# Altium schematic sheet SD_Card.SchDoc
size A4
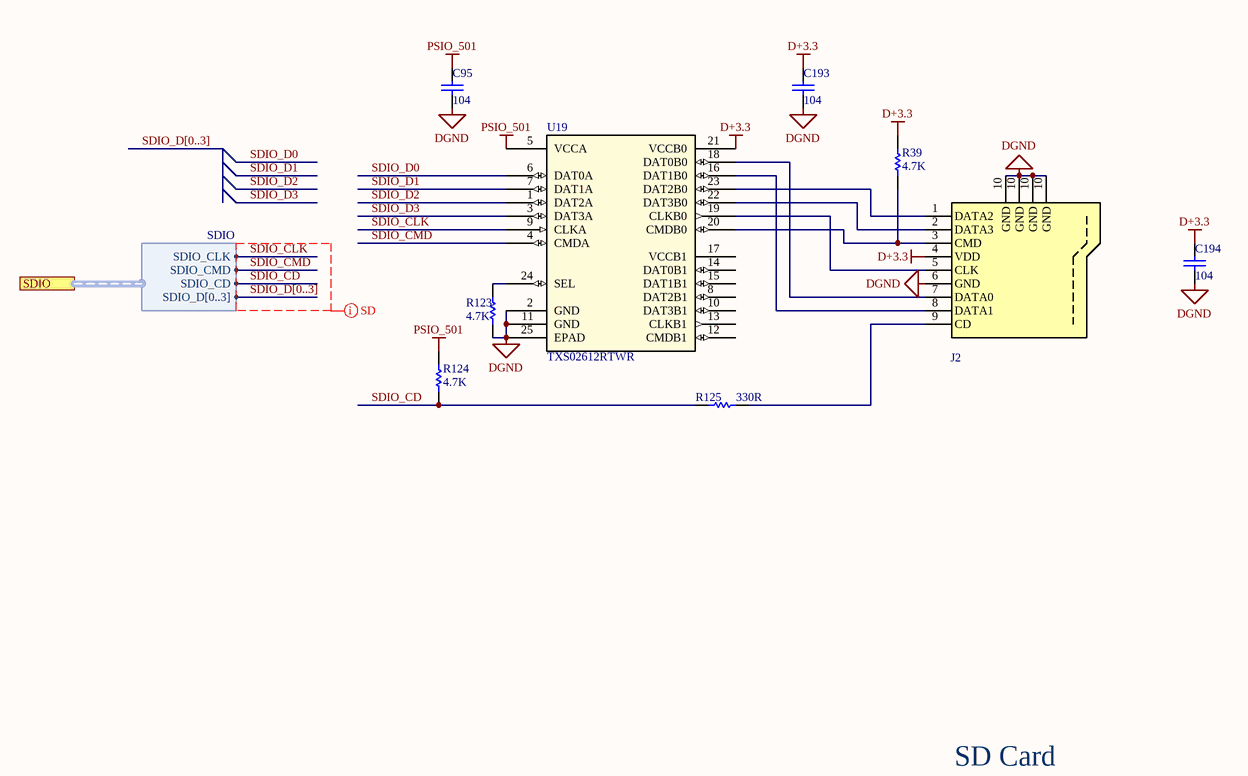
[diagram p0: SD_Card.SchDoc]

## Parts
C95  104  [C 0402_LL]
C193  104  [C 0402_LL]
C194  104  [C 0402_LL]
J2  SD_Card  [Micro SD]  (value not drawn)
R39  4.7K  [R 0603_L]
R123  4.7K  [R 0603_L]
R124  4.7K  [R 0603_L]
R125  330R  [R 0603_L]
U19  TXS02612RTWR  [RTW24_2P45X2P45]

## Ports
SDIO (harness SDIO)

## Harnesses
SDIO: SDIO_CLK, SDIO_CMD, SDIO_D[0..3], SDIO_CD

## Nets
D+3.3: C193.1 C194.1 J2.4(VDD) R39.1 U19.21(VCCB0)
DGND: C95.2 C193.2 C194.2 J2.6(GND) J2.10(GND) R123.2 U19.2(GND) U19.11(GND) U19.25(EPAD)
PSIO_501: C95.1 R124.1 U19.5(VCCA)
SDIO_CD: R124.2 R125.1 ; port SDIO.SDIO_CD
SDIO_CLK: U19.9(CLKA) ; port SDIO.SDIO_CLK
SDIO_CMD: U19.4(CMDA) ; port SDIO.SDIO_CMD
SDIO_D0: U19.6(DAT0A)
SDIO_D1: U19.7(DAT1A)
SDIO_D2: U19.1(DAT2A)
SDIO_D3: U19.3(DAT3A)
NetJ2_1: J2.1(DATA2) U19.23(DAT2B0)
NetJ2_2: J2.2(DATA3) U19.22(DAT3B0)
NetJ2_3: J2.3(CMD) R39.2 U19.20(CMDB0)
NetJ2_5: J2.5(CLK) U19.19(CLKB0)
NetJ2_7: J2.7(DATA0) U19.18(DAT0B0)
NetJ2_8: J2.8(DATA1) U19.16(DAT1B0)
NetJ2_9: J2.9(CD) R125.2
NetR123_1: R123.1 U19.24(SEL)

Not connected (* = marked no-connect by the designer): U19 8(DAT2B1) 10(DAT3B1) 12(CMDB1) 13(CLKB1) 14(DAT0B1) 15(DAT1B1) 17(VCCB1)

## Buses and harness runs
bus SDIO_D[0..3]

## Layout directives
net class SD: SDIO_CD, SDIO_CLK, SDIO_CMD, SDIO_D[0..3]

## Notes on the sheet
- SD Card

## Library data of the parts
C95 C193 C194 = Cap: Capacitor; Published: 8-Jun-2000; LatestRevisionDate: 17-Jul-2002; LatestRevisionNote: Re-released for DXP Platform.; PackageReference: RAD-0.3; Publisher: Altium Limited; PackageDescription: Radial Cap, Thru-Hole; 2 Leads; 0.3 in Pin Spacing
R39 R123-R125 = Res1: Resistor; Value: 1K; Published: 8-Jun-2000; LatestRevisionDate: 17-Jul-2002; LatestRevisionNote: Re-released for DXP Platform.; PackageReference: AXIAL-0.3; Publisher: Altium Limited; PackageDescription: Axial Device, Thru-Hole; 2 Leads; 0.3 in Pin Spacing
U19 = TXS02612RTWR: No Description Available; Mfr_Name: Texas Instruments; Copyright: Copyright (C) 2022 Ultra Librarian. All rights reserved.; Manufacturer_Part_Number: TXS02612RTWR; RefDes: RefDes; Type: DEV